# EAGLE design ZXseries (EAGLE 8.6.0)
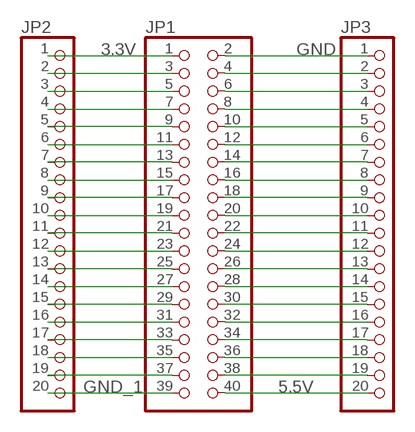
[diagram p0: schematic, sheet 1]

## Parts
JP1  PINHD-2X20  [2X20]
JP2  PINHD-1X20  [1X20]
JP3  PINHD-1X20  [1X20]

## Nets
3.3V: JP1.1 JP2.1
5.5V: JP1.40 JP3.20
GND: JP1.2 JP3.1
GND_1: JP1.39 JP2.20
N$2: JP1.3 JP2.2
N$3: JP1.5 JP2.3
N$4: JP1.7 JP2.4
N$6: JP1.4 JP3.2
N$7: JP1.6 JP3.3
N$8: JP1.8 JP3.4
N$9: JP1.10 JP3.5
N$10: JP1.9 JP2.5
N$11: JP1.11 JP2.6
N$12: JP1.12 JP3.6
N$13: JP1.14 JP3.7
N$14: JP1.13 JP2.7
N$15: JP1.15 JP2.8
N$16: JP1.16 JP3.8
N$17: JP1.18 JP3.9
N$18: JP1.17 JP2.9
N$19: JP1.19 JP2.10
N$20: JP1.20 JP3.10
N$21: JP1.22 JP3.11
N$22: JP1.21 JP2.11
N$23: JP1.23 JP2.12
N$24: JP1.24 JP3.12
N$25: JP1.26 JP3.13
N$26: JP1.25 JP2.13
N$27: JP1.27 JP2.14
N$28: JP1.28 JP3.14
N$29: JP1.30 JP3.15
N$30: JP1.29 JP2.15
N$31: JP1.31 JP2.16
N$32: JP1.32 JP3.16
N$33: JP1.34 JP3.17
N$34: JP1.33 JP2.17
N$35: JP1.35 JP2.18
N$36: JP1.36 JP3.18
N$37: JP1.38 JP3.19
N$38: JP1.37 JP2.19

## Library data of the parts
JP1 = pinhead:PINHD-2X20: PIN HEADER
JP2 JP3 = pinhead:PINHD-1X20: PIN HEADER

## Board
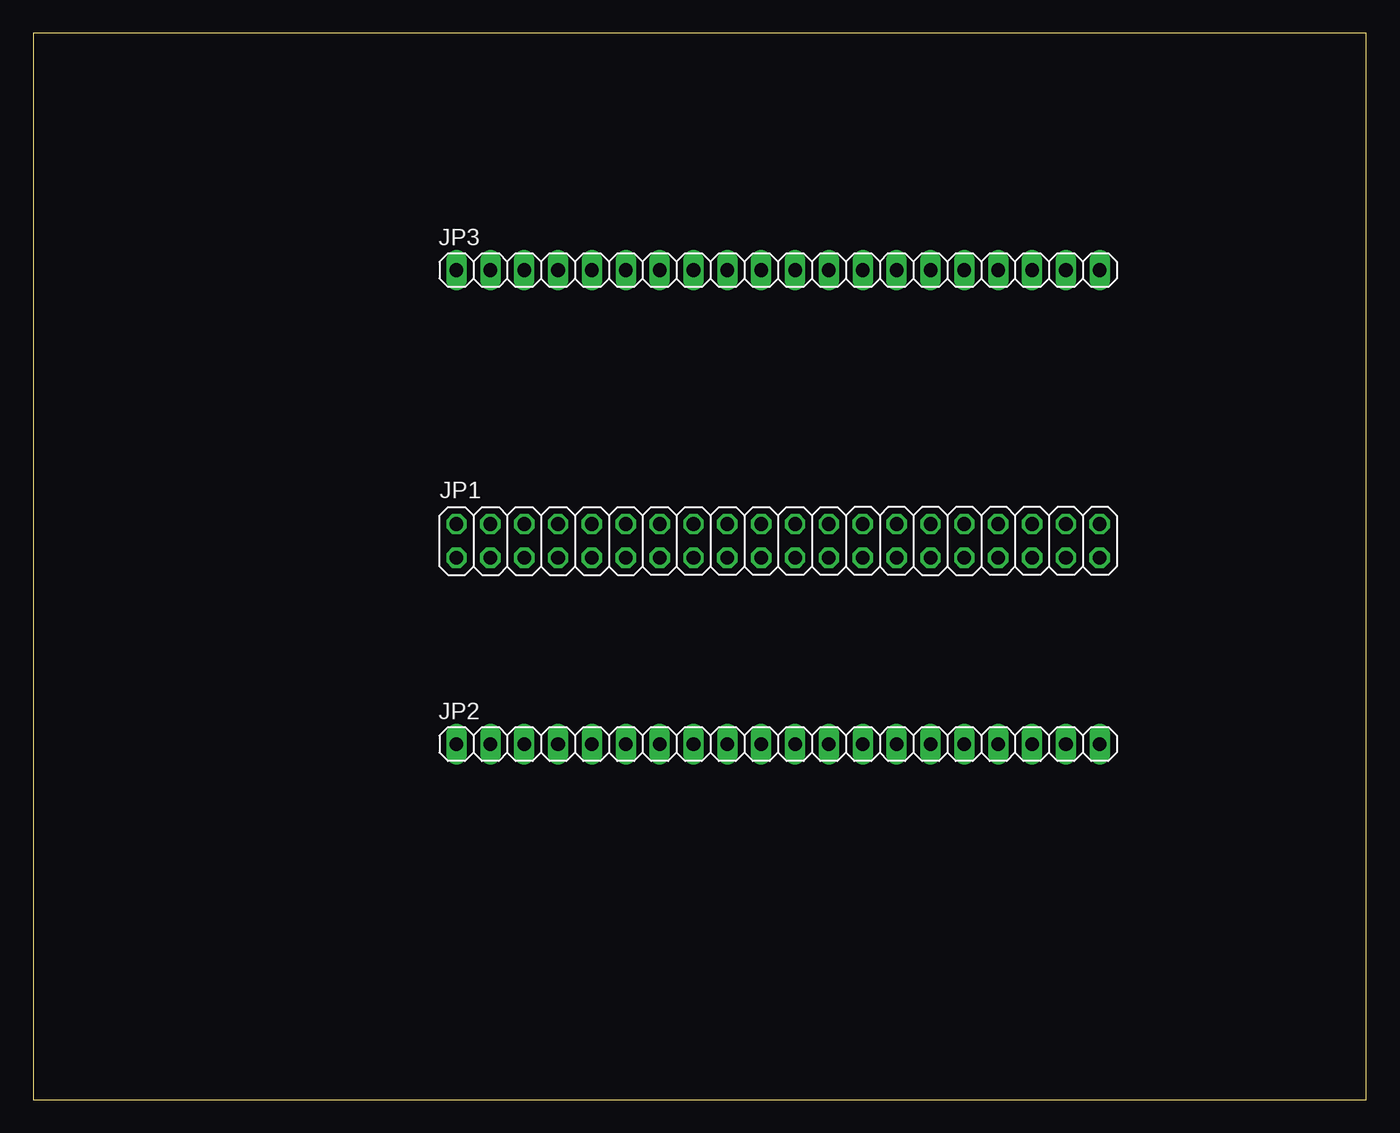
[diagram p1: board, top side]
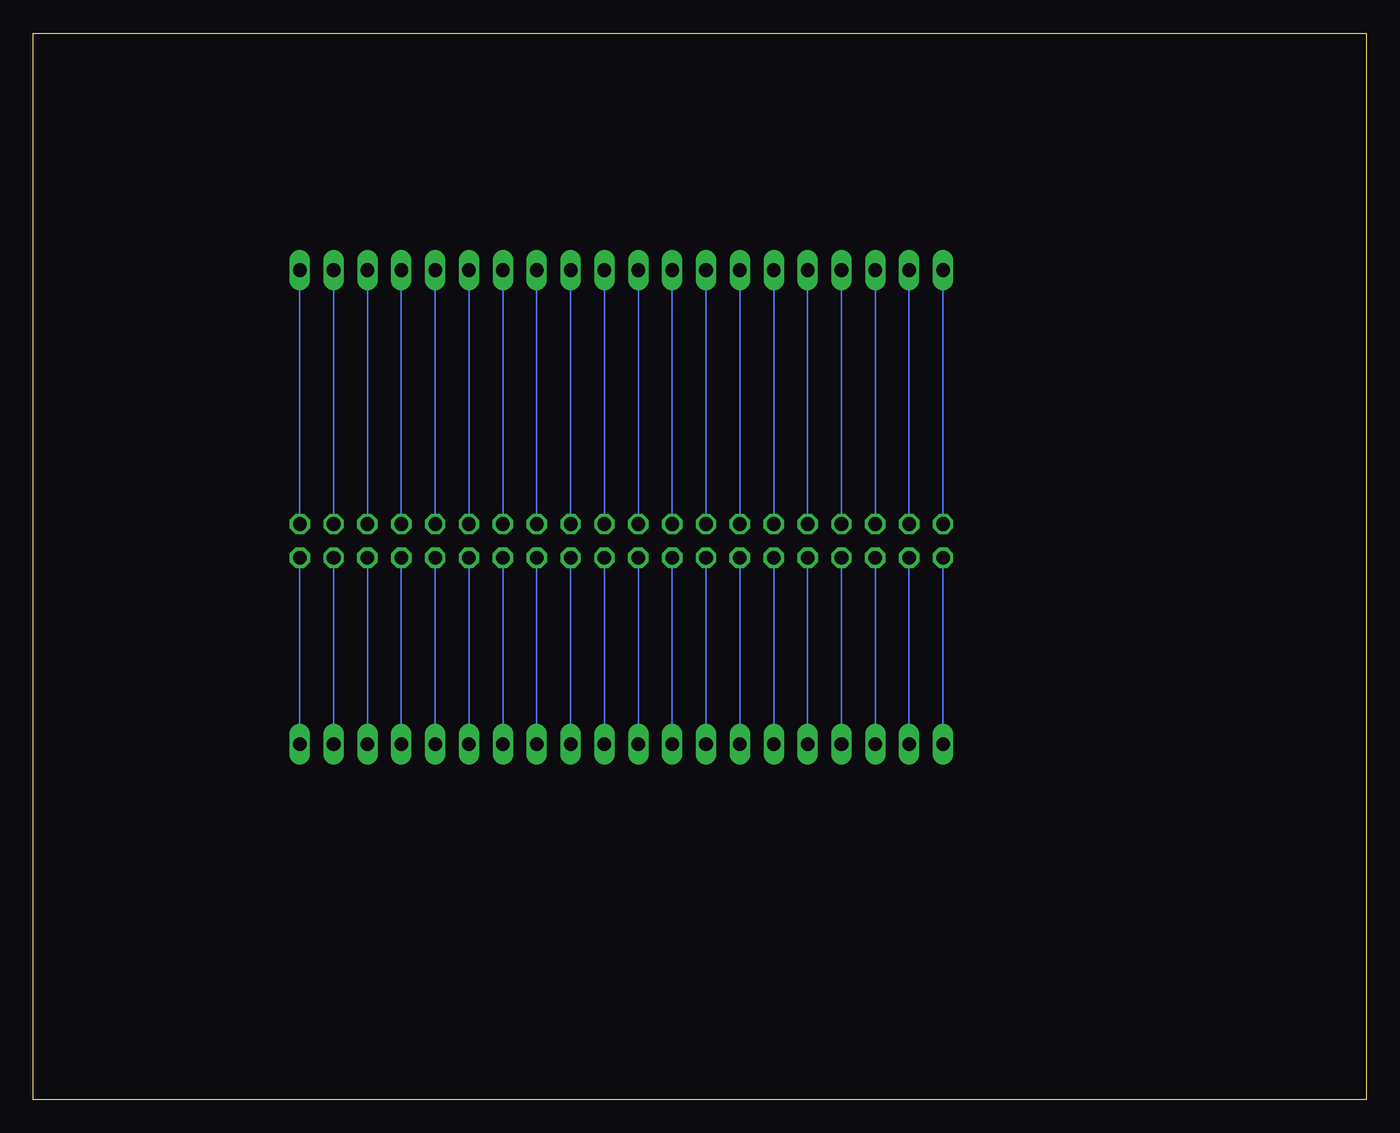
[diagram p2: board, bottom side, seen from below]

Size 100 x 80 mm. Coordinates in mm from the lower left corner, seen from the top.
Outline: 0,0 100,0 100,80 0,80 0,0
Copper layers (1*16): Top 0.035559375mm / dielectric 1.6mm / Bottom 0.035559375mm
Design rules "oshpark-2layer-auto-routing": minimum track width 10mil, minimum drill 10mil, track to track 10mil, track to pad 8mil, pad to pad 8mil, via to via 8mil, smd to smd 6mil, copper to edge 15mil, drill to drill 6mil, minimum pad ring 6mil, minimum via ring 6mil, stop-mask expansion 2.5mil, vias tented up to drill 0mil, thermal gap 10mil

### Footprints (pad centres in the part's own frame; a part is rotated, then mirrored left to right if it is on the bottom)
2X20 = drill 1.016 octagon: 1 -24.13,-1.27; 2 -24.13,1.27; 3 -21.59,-1.27; 4 -21.59,1.27; 5 -19.05,-1.27; 6 -19.05,1.27; 7 -16.51,-1.27; 8 -16.51,1.27; 9 -13.97,-1.27; 10 -13.97,1.27; 11 -11.43,-1.27; 12 -11.43,1.27; 13 -8.89,-1.27; 14 -8.89,1.27; 15 -6.35,-1.27; 16 -6.35,1.27; 17 -3.81,-1.27; 18 -3.81,1.27; 19 -1.27,-1.27; 20 -1.27,1.27; 21 1.27,-1.27; 22 1.27,1.27; 23 3.81,-1.27; 24 3.81,1.27; 25 6.35,-1.27; 26 6.35,1.27; 27 8.89,-1.27; 28 8.89,1.27; 29 11.43,-1.27; 30 11.43,1.27; 31 13.97,-1.27; 32 13.97,1.27; 33 16.51,-1.27; 34 16.51,1.27; 35 19.05,-1.27; 36 19.05,1.27; 37 21.59,-1.27; 38 21.59,1.27; 39 24.13,-1.27; 40 24.13,1.27
1X20 = drill 1.016 long: 1 -24.13,0; 2 -21.59,0; 3 -19.05,0; 4 -16.51,0; 5 -13.97,0; 6 -11.43,0; 7 -8.89,0; 8 -6.35,0; 9 -3.81,0; 10 -1.27,0; 11 1.27,0; 12 3.81,0; 13 6.35,0; 14 8.89,0; 15 11.43,0; 16 13.97,0; 17 16.51,0; 18 19.05,0; 19 21.59,0; 20 24.13,0

### Placement (x,y rotation side)
JP1  55.88,41.91 0 top
JP2  55.88,26.67 0 top
JP3  55.88,62.23 0 top

### Tracks (layer width: path | path; a pad name or v marks a point on that pad's centre or on a via)
3.3V
  Bottom 0.127: JP1.1 JP2.1
5.5V
  Bottom 0.127: JP1.40 JP3.20
GND
  Bottom 0.127: JP3.1 JP1.2
GND_1
  Bottom 0.127: JP2.20 JP1.39
N$2
  Bottom 0.127: JP2.2 JP1.3
N$3
  Bottom 0.127: JP1.5 JP2.3
N$4
  Bottom 0.127: JP2.4 JP1.7
N$6
  Bottom 0.127: JP1.4 JP3.2
N$7
  Bottom 0.127: JP3.3 JP1.6
N$8
  Bottom 0.127: JP1.8 JP3.4
N$9
  Bottom 0.127: JP3.5 JP1.10
N$10
  Bottom 0.127: JP1.9 JP2.5
N$11
  Bottom 0.127: JP2.6 JP1.11
N$12
  Bottom 0.127: JP1.12 JP3.6
N$13
  Bottom 0.127: JP3.7 JP1.14
N$14
  Bottom 0.127: JP1.13 JP2.7
N$15
  Bottom 0.127: JP2.8 JP1.15
N$16
  Bottom 0.127: JP1.16 JP3.8
N$17
  Bottom 0.127: JP3.9 JP1.18
N$18
  Bottom 0.127: JP1.17 JP2.9
N$19
  Bottom 0.127: JP2.10 JP1.19
N$20
  Bottom 0.127: JP1.20 JP3.10
N$21
  Bottom 0.127: JP3.11 JP1.22
N$22
  Bottom 0.127: JP1.21 JP2.11
N$23
  Bottom 0.127: JP2.12 JP1.23
N$24
  Bottom 0.127: JP1.24 JP3.12
N$25
  Bottom 0.127: JP3.13 JP1.26
N$26
  Bottom 0.127: JP1.25 JP2.13
N$27
  Bottom 0.127: JP2.14 JP1.27
N$28
  Bottom 0.127: JP1.28 JP3.14
N$29
  Bottom 0.127: JP3.15 JP1.30
N$30
  Bottom 0.127: JP1.29 JP2.15
N$31
  Bottom 0.127: JP2.16 JP1.31
N$32
  Bottom 0.127: JP1.32 JP3.16
N$33
  Bottom 0.127: JP3.17 JP1.34
N$34
  Bottom 0.127: JP1.33 JP2.17
N$35
  Bottom 0.127: JP2.18 JP1.35
N$36
  Bottom 0.127: JP1.36 JP3.18
N$37
  Bottom 0.127: JP3.19 JP1.38
N$38
  Bottom 0.127: JP1.37 JP2.19